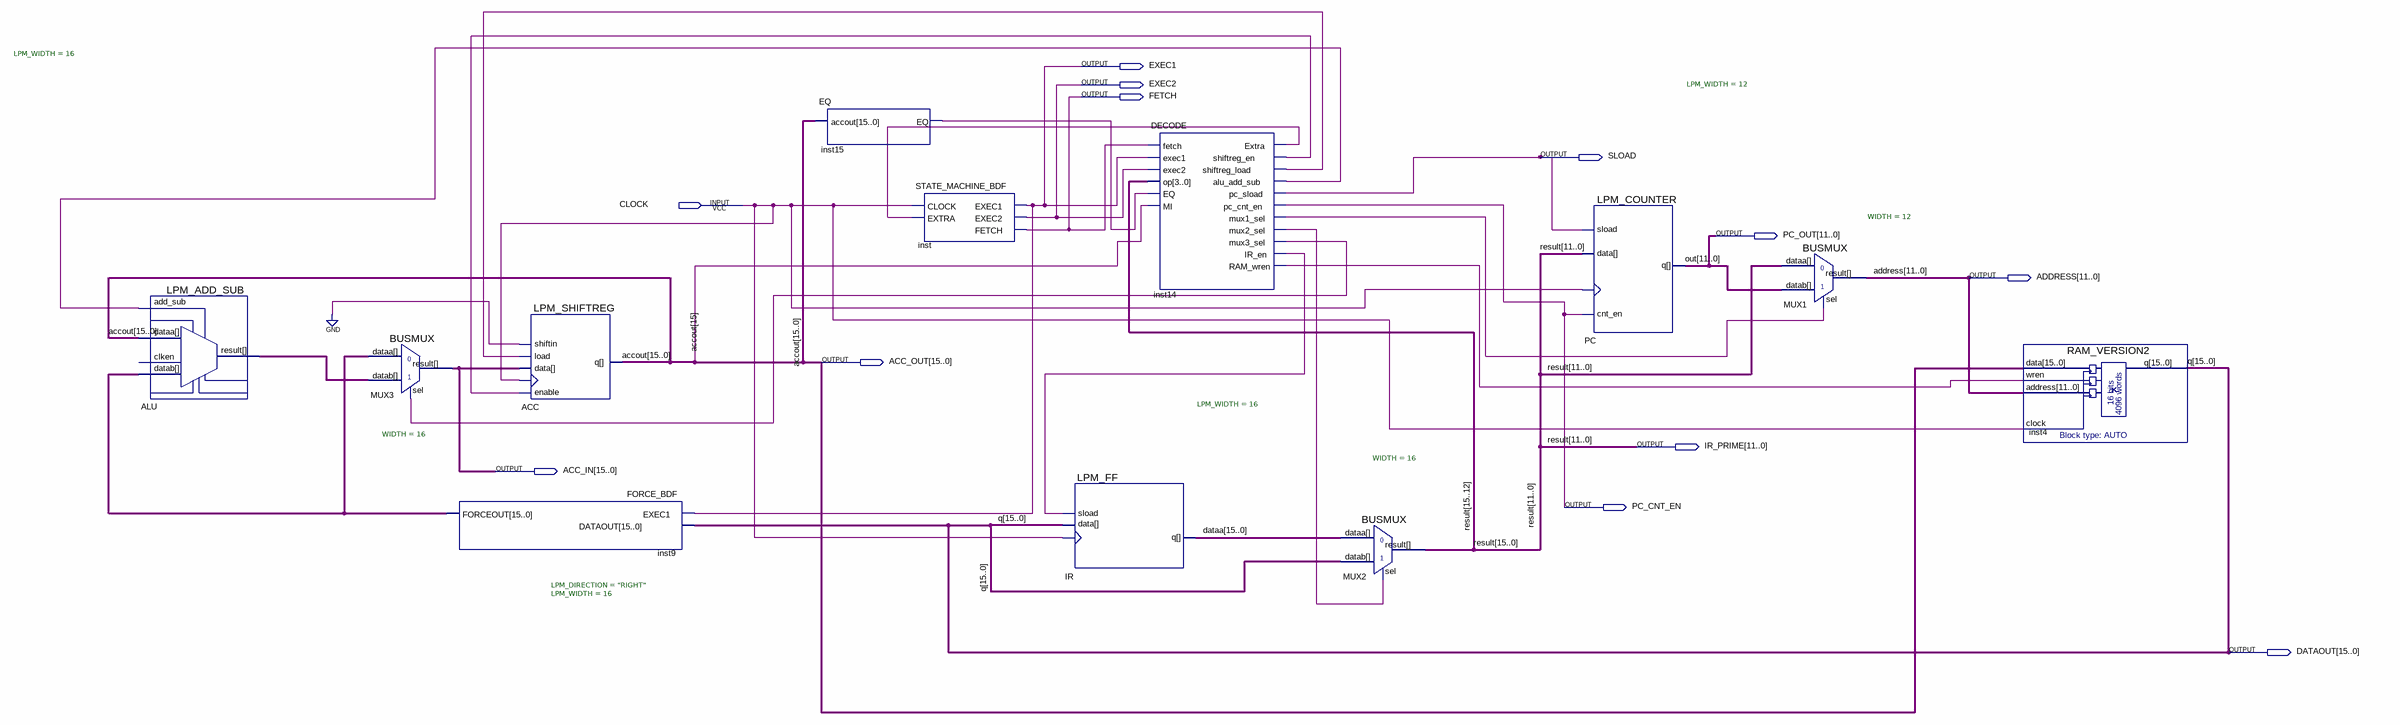
[diagram p0: schematic sheet]
// Quartus schematic TASK8.bdf as structural Verilog: 12 symbols, 12 pins
module TASK8 (
  input  CLOCK,
  output EXEC1,
  output EXEC2,
  output FETCH,
  output SLOAD,
  output [11:0] PC_OUT,
  output [11:0] ADDRESS,
  output [15:0] ACC_OUT,
  output [11:0] IR_PRIME,
  output [15:0] ACC_IN,
  output PC_CNT_EN,
  output [15:0] DATAOUT
);

  wire inst14_alu_add_sub, inst14_extra, inst14_ir_en, inst14_mux1_sel, inst14_mux2_sel, inst14_mux3_sel,
       inst14_ram_wren, inst14_shiftreg_en, inst14_shiftreg_load, inst15_eq;
  wire [15:0] ALU_result, dataa, inst9_forceout;
  wire [15:12] result;

  LPM_ADD_SUB #(.LPM_WIDTH(16)) ALU (
    .add_sub(inst14_alu_add_sub), .dataa(ACC_OUT), .datab(inst9_forceout), .result(ALU_result));  // open: clken
  BUSMUX #(.WIDTH(16)) MUX3 (.datab(ALU_result), .sel(inst14_mux3_sel), .dataa(inst9_forceout), .result(ACC_IN));
  FORCE_BDF inst9 (.EXEC1(EXEC1), .DATAOUT(DATAOUT), .FORCEOUT(inst9_forceout));
  LPM_SHIFTREG #(.LPM_DIRECTION("RIGHT"), .LPM_WIDTH(16)) ACC (
    .clock(CLOCK), .data(ACC_IN), .enable(inst14_shiftreg_en), .load(inst14_shiftreg_load), .shiftin(1'b0),
    .q(ACC_OUT));
  EQ inst15 (.accout(ACC_OUT), .EQ(inst15_eq));
  STATE_MACHINE_BDF inst (.CLOCK(CLOCK), .EXTRA(inst14_extra), .EXEC1(EXEC1), .EXEC2(EXEC2), .FETCH(FETCH));
  LPM_FF #(.LPM_WIDTH(16)) IR (.clock(CLOCK), .data(DATAOUT), .sload(inst14_ir_en), .q(dataa));
  DECODE inst14 (
    .fetch(FETCH), .exec1(EXEC1), .exec2(EXEC2), .op(result), .EQ(inst15_eq), .MI(ACC_OUT[15]),
    .Extra(inst14_extra), .shiftreg_en(inst14_shiftreg_en), .shiftreg_load(inst14_shiftreg_load),
    .alu_add_sub(inst14_alu_add_sub), .pc_sload(SLOAD), .pc_cnt_en(PC_CNT_EN), .mux1_sel(inst14_mux1_sel),
    .mux2_sel(inst14_mux2_sel), .mux3_sel(inst14_mux3_sel), .IR_en(inst14_ir_en), .RAM_wren(inst14_ram_wren));
  BUSMUX #(.WIDTH(16)) MUX2 (.datab(DATAOUT), .sel(inst14_mux2_sel), .dataa(dataa), .result({result, IR_PRIME}));
  LPM_COUNTER #(.LPM_WIDTH(12)) PC (.clock(CLOCK), .cnt_en(PC_CNT_EN), .data(IR_PRIME), .sload(SLOAD), .q(PC_OUT));
  BUSMUX #(.WIDTH(12)) MUX1 (.datab(PC_OUT), .sel(inst14_mux1_sel), .dataa(IR_PRIME), .result(ADDRESS));
  RAM_VERSION2 inst4 (.data(ACC_OUT), .wren(inst14_ram_wren), .address(ADDRESS), .clock(CLOCK), .q(DATAOUT));

  // Other names for the same wires on the sheet: accout[15:0] = ACC_OUT; q[15:0] = DATAOUT; out[11:0] = PC_OUT;
  //   result[11:0] = IR_PRIME
endmodule
